# Altium schematic sheet 3_Communication.SchDoc
size A4; SheetNumber: 3; SheetTotal: 4
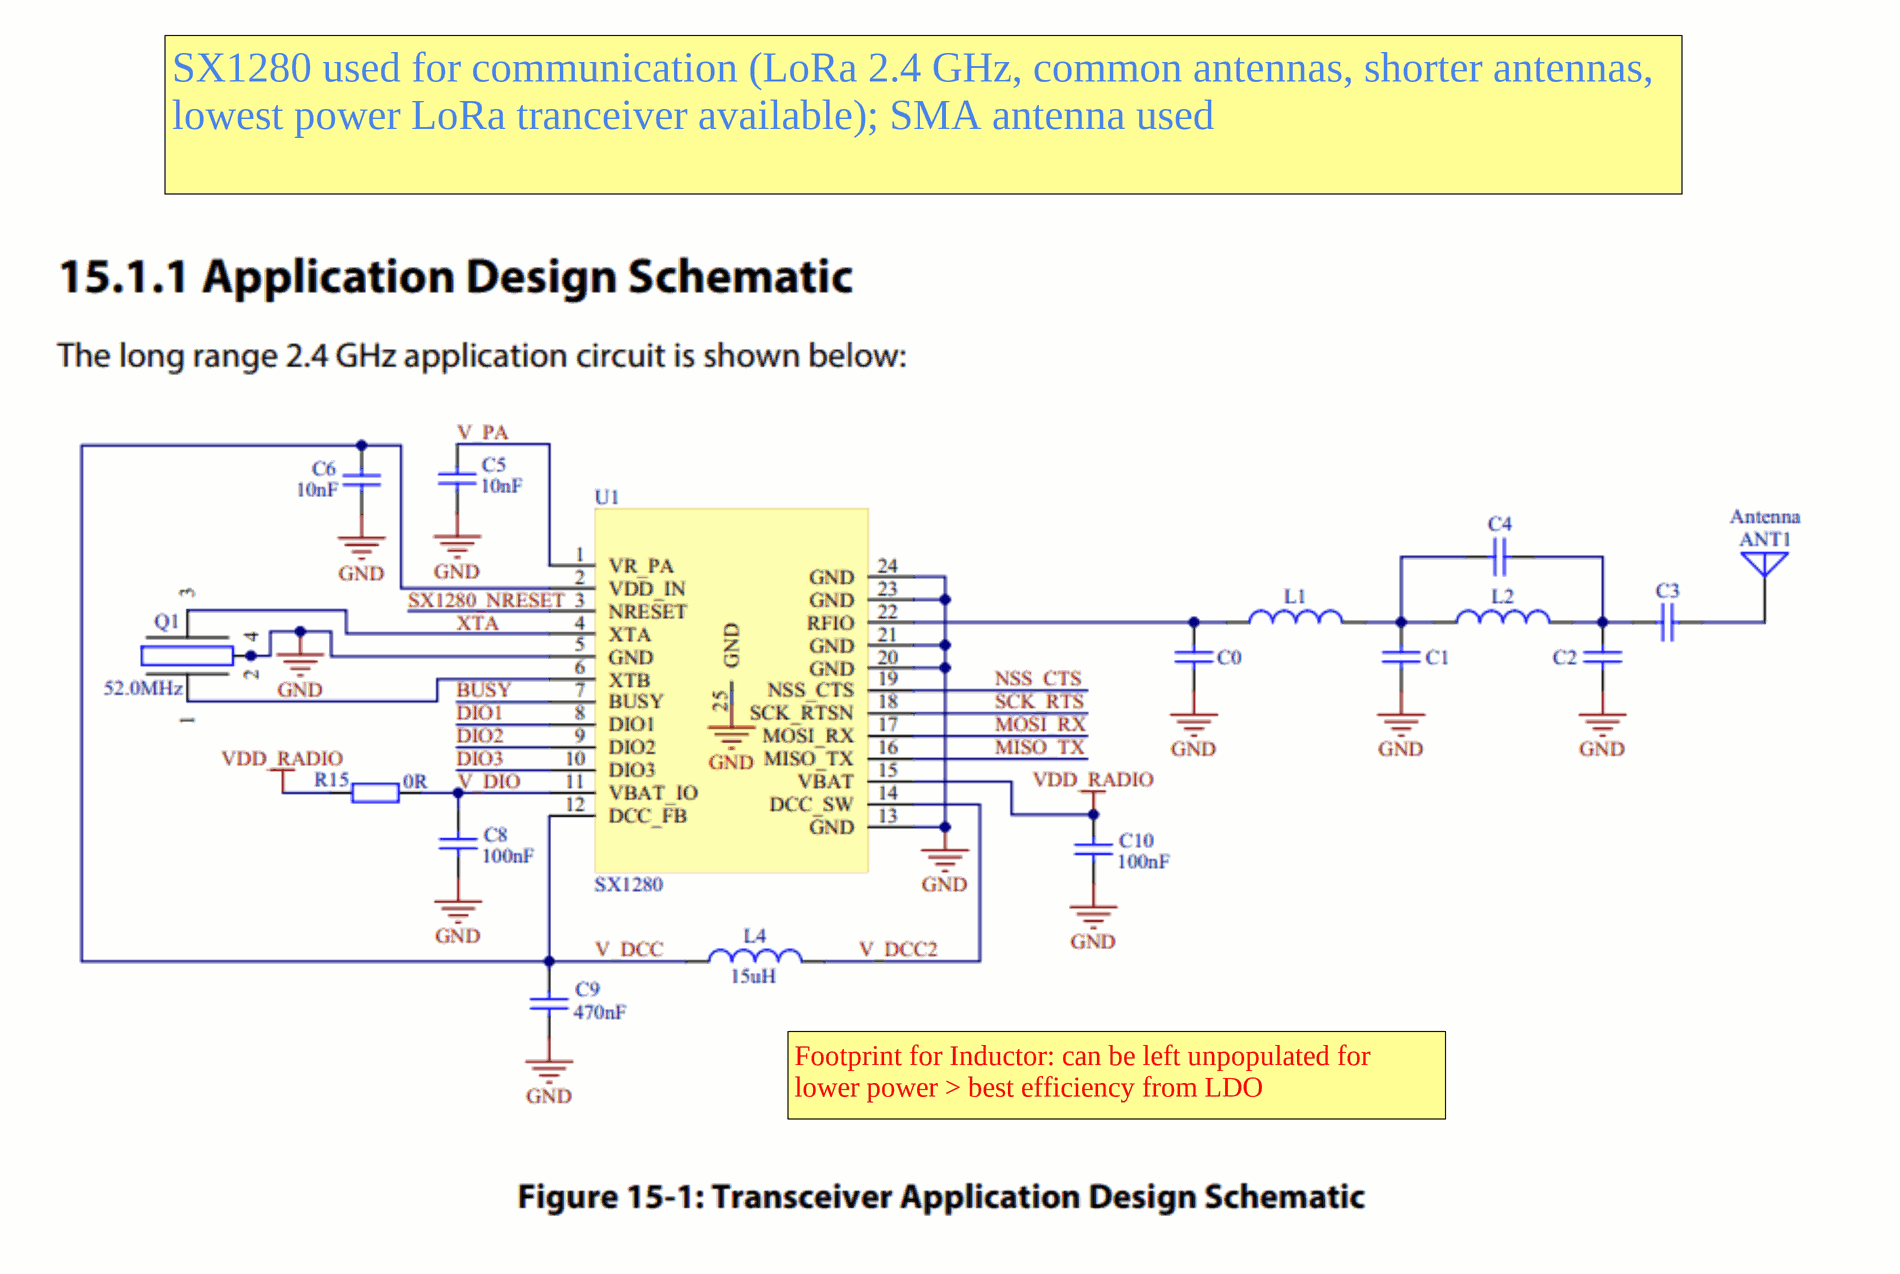
[diagram p0: 3_Communication.SchDoc, left]
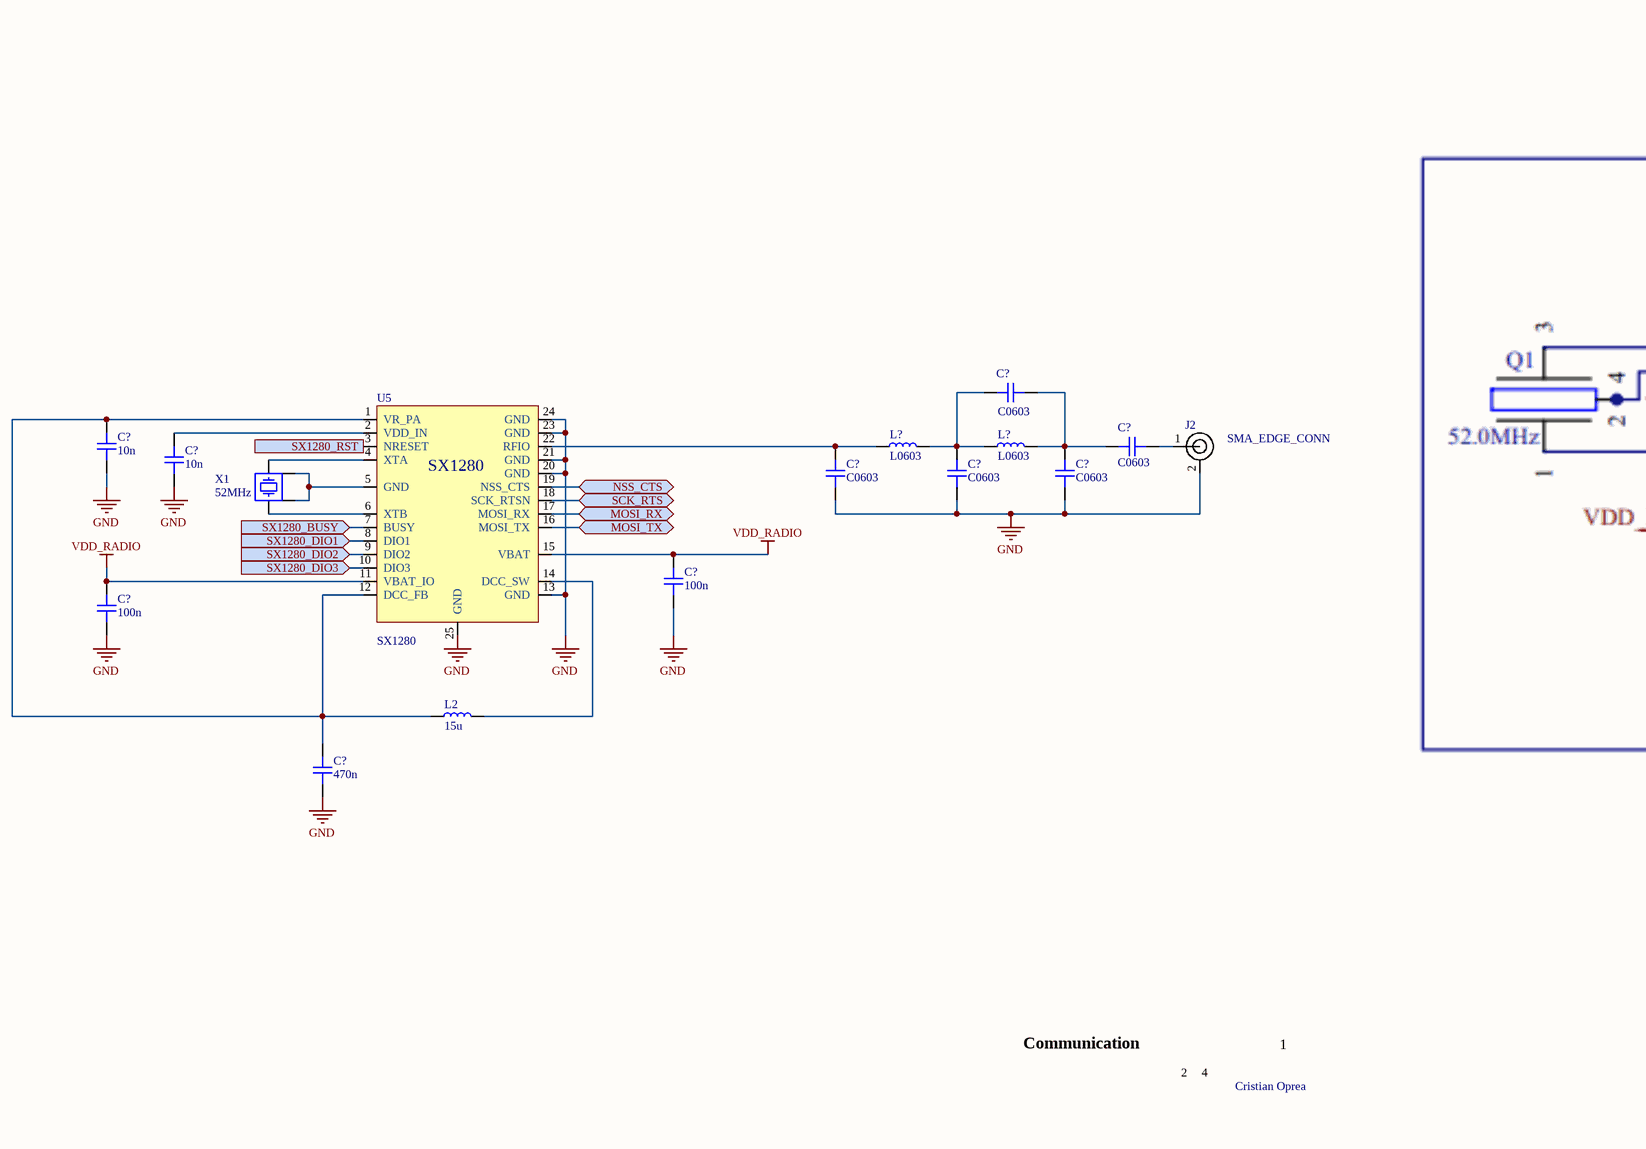
[diagram p1: 3_Communication.SchDoc, middle]
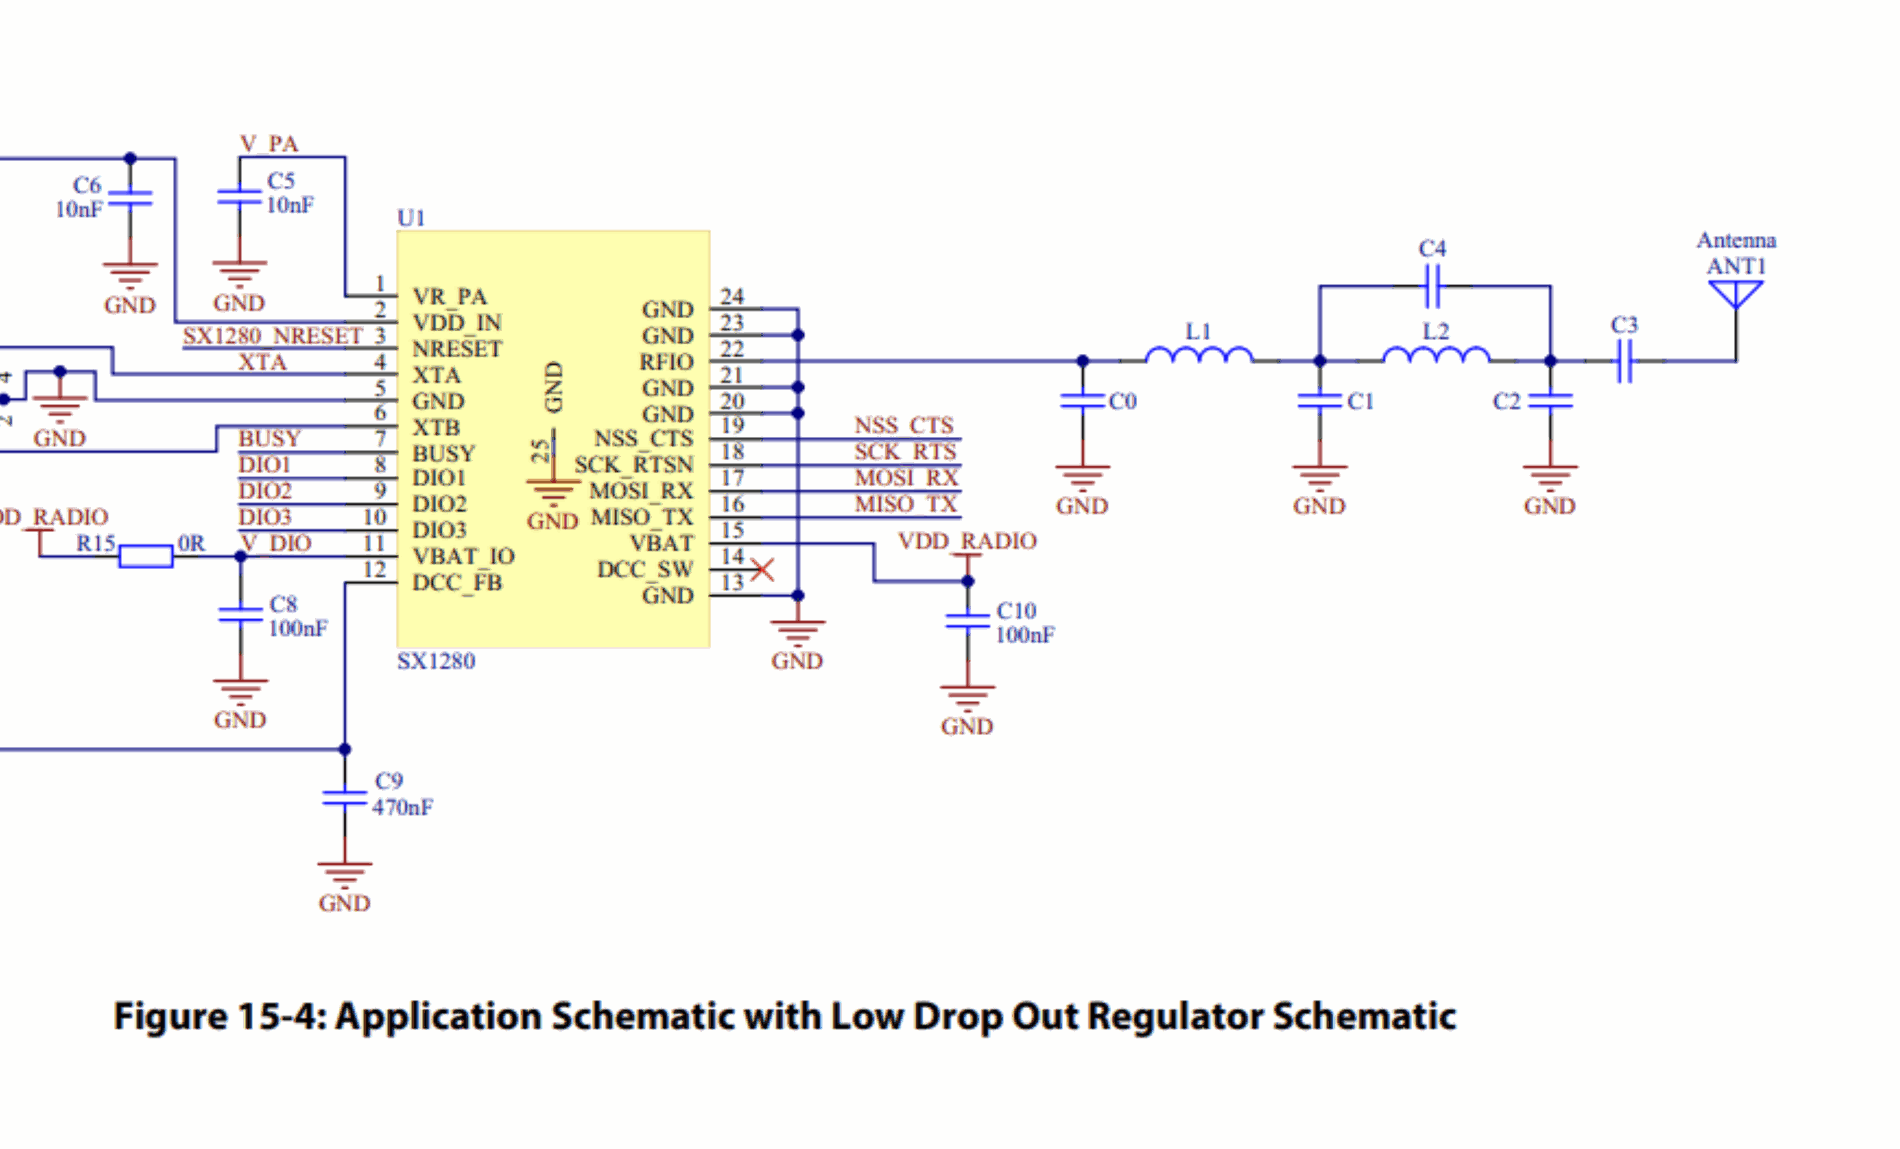
[diagram p2: 3_Communication.SchDoc, right]

## Parts
(Parts that share a designator on the sheet are numbered #1, #2 ... from top to bottom, then left to right.)
C?#1  C0603  [CAP_0603]
C?#2  10n  [CAP_0603]
C?#3  C0603  [CAP_0603]
C?#4  10n  [CAP_0603]
C?#5  C0603  [CAP_0603]
C?#6  C0603  [CAP_0603]
C?#7  C0603  [CAP_0603]
C?#8  100n  [CAP_0603]
C?#9  100n  [CAP_0603]
C?#10  470n  [CAP_0603]
J2  SMA_EDGE_CONN  [CON-SMA-EDGE-S]
L2  15u  [IND_0603]
L?#1  L0603  [IND_0603]
L?#2  L0603  [IND_0603]
U5  SX1280
X1  52MHz  [XTAL_3225]

## Ports
MOSI_RX (bidir), MOSI_TX (bidir), NSS_CTS (bidir), SCK_RTS (bidir), SX1280_BUSY (in), SX1280_DIO1 (in), SX1280_DIO2 (in), SX1280_DIO3 (in), SX1280_RST (in)

## Nets
GND: C?#2.1 C?#4.1 C?#5.1 C?#6.1 C?#7.1 C?#8.1 C?#9.1 C?#10.1 J2.2 U5.13(GND) U5.20(GND) U5.21(GND) U5.23(GND) U5.24(GND) U5.25(GND)
VDD_RADIO: C?#8.2 C?#9.2 U5.11(VBAT_IO) U5.15(VBAT)
MOSI_RX: U5.17(MOSI_RX) ; port MOSI_RX
MOSI_TX: U5.16(MOSI_TX) ; port MOSI_TX
NSS_CTS: U5.19(NSS_CTS) ; port NSS_CTS
SCK_RTS: U5.18(SCK_RTSN) ; port SCK_RTS
SX1280_BUSY: U5.7(BUSY) ; port SX1280_BUSY
SX1280_DIO1: U5.8(DIO1) ; port SX1280_DIO1
SX1280_DIO2: U5.9(DIO2) ; port SX1280_DIO2
SX1280_DIO3: U5.10(DIO3) ; port SX1280_DIO3
SX1280_RST: U5.3(NRESET) ; port SX1280_RST
NetC?#1_1: C?#1.1 C?#3.2 C?#7.2 L?#2.2
NetC?#1_2: C?#1.2 C?#6.2 L?#1.2 L?#2.1
NetC?#2_2: C?#2.2 C?#10.2 L2.1 U5.1(VR_PA) U5.12(DCC_FB)
NetC?#3_1: C?#3.1 J2.1
NetC?#4_2: C?#4.2 U5.2(VDD_IN)
NetC?#5_2: C?#5.2 L?#1.1 U5.22(RFIO)
NetL2_2: L2.2 U5.14(DCC_SW)
NetU5_4: U5.4(XTA) X1.3
NetU5_5: U5.5(GND) X1.2 X1.4
NetU5_6: U5.6(XTB) X1.1

## Notes on the sheet
- SX1280 used for communication (LoRa 2.4 GHz, common antennas, shorter antennas, lowest power LoRa tranceiver available); SMA antenna used
- Values based on antenna input imedance
- Footprint for Inductor: can be left unpopulated for lower power > best efficiency from LDO
- Communication
- 2
- 4
- 1
- Cristian Oprea

## Library data of the parts
C?#1-C?#10 = CAP_0603: Capacitor SMD 0603; Manufacturer: *; Manufacturer Part Number: *; Distributor Link: *; LCSC: *; Rating: *; Dielectric: *
J2 = CON-SMA-EDGE-S: RF Connector SMA Female 50 Ohms 18 GHz PCB Edge Mount; Manufacturer: RF Solutions; Manufacturer Part Number: CON-SMA-EDGE-S
L2 L?#1 L?#2 = IND_0603: Inductor SMD 0603
U5 = SX1280: Low power LoRa transceiver operating at 2.4GHz with ranging capability
X1 = Crystal: Manufacturer: Epson; Manufacturer Part Number: TSX-3225 24.0000MF15X-AC